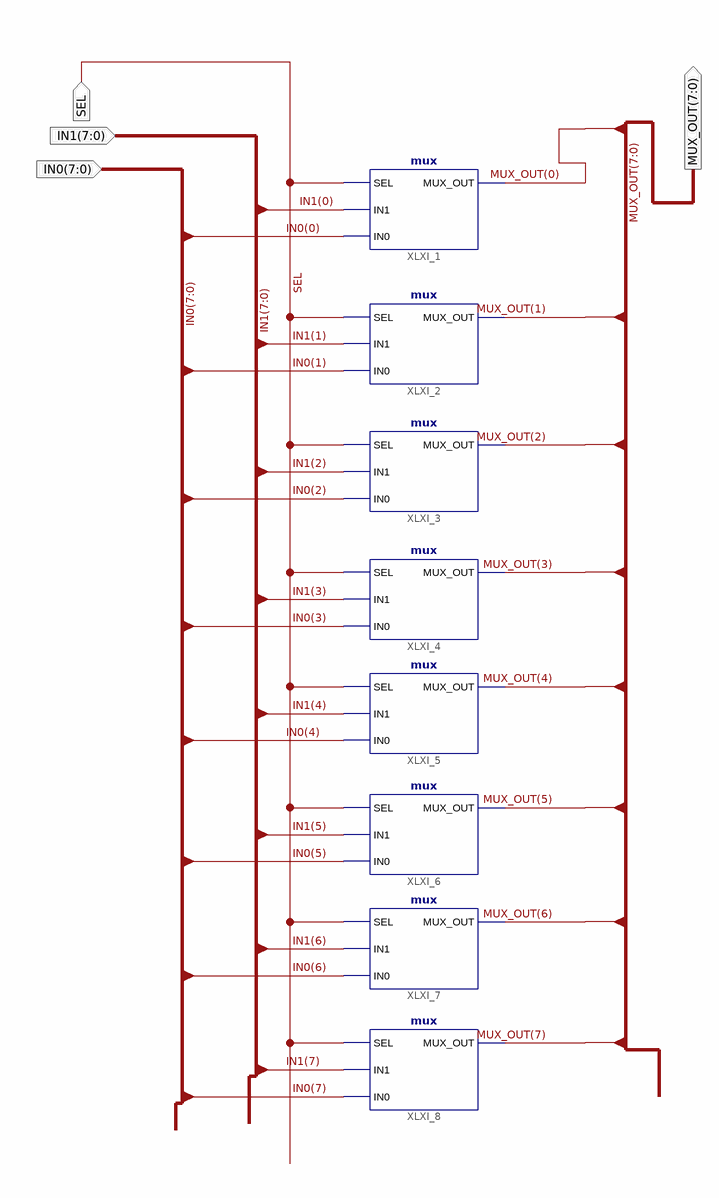
[diagram p0: schematic sheet 1]
// Xilinx ISE schematic mux8sch.sch (spartan3e) as structural Verilog: 8 symbols, 4 ports
module mux8sch (
  input  SEL,
  input  [7:0] IN1,
  input  [7:0] IN0,
  output [7:0] MUX_OUT
);

  mux XLXI_1 (.IN1(IN1[0]), .IN0(IN0[0]), .SEL(SEL), .MUX_OUT(MUX_OUT[0]));
  mux XLXI_2 (.IN1(IN1[1]), .IN0(IN0[1]), .SEL(SEL), .MUX_OUT(MUX_OUT[1]));
  mux XLXI_3 (.IN1(IN1[2]), .IN0(IN0[2]), .SEL(SEL), .MUX_OUT(MUX_OUT[2]));
  mux XLXI_4 (.IN1(IN1[3]), .IN0(IN0[3]), .SEL(SEL), .MUX_OUT(MUX_OUT[3]));
  mux XLXI_5 (.IN1(IN1[4]), .IN0(IN0[4]), .SEL(SEL), .MUX_OUT(MUX_OUT[4]));
  mux XLXI_6 (.IN1(IN1[5]), .IN0(IN0[5]), .SEL(SEL), .MUX_OUT(MUX_OUT[5]));
  mux XLXI_7 (.IN1(IN1[6]), .IN0(IN0[6]), .SEL(SEL), .MUX_OUT(MUX_OUT[6]));
  mux XLXI_8 (.IN1(IN1[7]), .IN0(IN0[7]), .SEL(SEL), .MUX_OUT(MUX_OUT[7]));
endmodule
